# EAGLE design iBolit2_daughter (EAGLE 7.5.0)
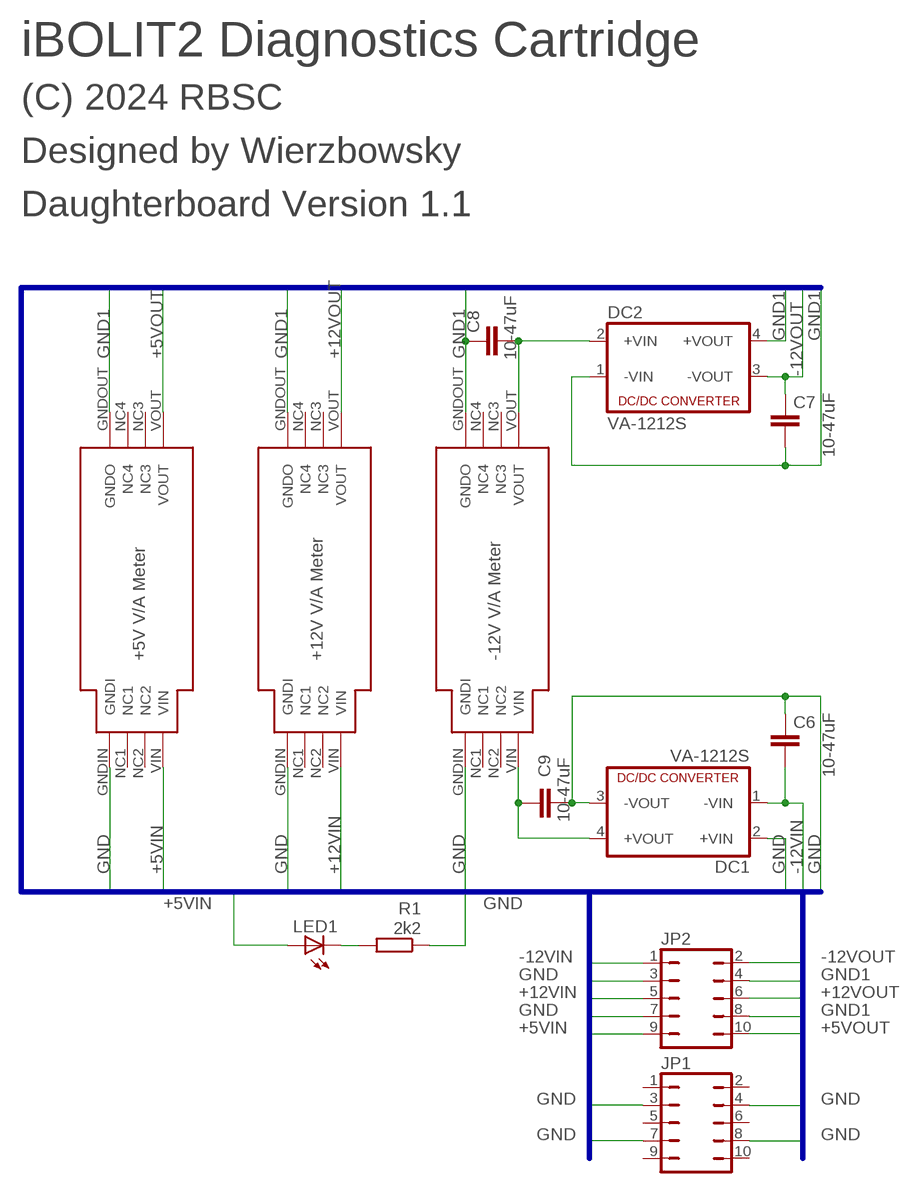
[diagram p0: schematic, sheet 1]

## Parts
C6  10-47uF  C-EUC1210  [C1210]
C7  10-47uF  C-EUC1210  [C1210]
C8  10-47uF  C-EUC1210  [C1210]
C9  10-47uF  C-EUC1210  [C1210]
DC1  VA-1212S  [4SIL]
DC2  VA-1212S  [4SIL]
JP1  JP5Q_CUSTOM  [JP5Q_CUSTOM]
JP2  JP5Q_CUSTOM  [JP5Q_CUSTOM]
LED1  LEDSQR2X5  [LED2X5]
R1  2k2  R-EU_R0805  [R0805]
X1  VA-METER2  [VA_METER2]
X2  VA-METER2  [VA_METER2]
X3  VA-METER2  [VA_METER2]

## Nets
+5VIN: JP2.9 LED1.A X1.VIN
+5VOUT: JP2.10 X1.VOUT
+12VCONVI: C9.1 DC1.4(+VOUT) X3.VIN
+12VCONVO: C8.2 DC2.2(+VIN) X3.VOUT
+12VIN: JP2.5 X2.VIN
+12VOUT: JP2.6 X2.VOUT
-12VIN: C6.2 DC1.1(-VIN) JP2.1
-12VOUT: C7.1 DC2.3(-VOUT) JP2.2
GND: C6.1 C9.2 DC1.2(+VIN) DC1.3(-VOUT) JP1.3 JP1.4 JP1.7 JP1.8 JP2.3 JP2.7 R1.1 X1.GNDIN(GNDI) X2.GNDIN(GNDI) X3.GNDIN(GNDI)
GND1: C7.2 C8.1 DC2.1(-VIN) DC2.4(+VOUT) JP2.4 JP2.8 X1.GNDOUT(GNDO) X2.GNDOUT(GNDO) X3.GNDOUT(GNDO)
N$1: LED1.K(C) R1.2
Unconnected: JP1.1 JP1.2 JP1.5 JP1.6 JP1.9 JP1.10 X1.NC1 X1.NC2 X1.NC3 X1.NC4 X2.NC1 X2.NC2 X2.NC3 X2.NC4 X3.NC1 X3.NC2 X3.NC3 X3.NC4

## Buses
D0,D1,D2,D3,D4,D5,D6,D7,A0,A1,A2,A3,A4,A5,A6,A7,A8,A9,A10,A11,A12,A13,A14,A15,SLTSL,RFSH,WAIT,INT,M1,BUSDIR,IORQ,MERQ,WR,RD,RESET,GND,CLOCK,SW1,SW2,CS1,CS2,CS12,SNDIN,GND1,GND2,+5V1,+5V2,+12V,-12V,+5VIN,+5VOUT,+12VIN,+12VOUT,-12VIN,-12VOUT,GND,GND1

## Notes on the sheet
- iBOLIT2 Diagnostics Cartridge
- (C) 2024 RBSC
- Designed by Wierzbowsky
- Daughterboard Version 1.1
- +5V V/A Meter | +12V V/A Meter | -12V V/A Meter

## Library data of the parts
C6-C9 = rcl:C-EU: CAPACITOR, European symbol
DC1 DC2 = dc-dc-converter:VA-*?: DC DC Converter Single Output, 1 Watt Motien Technology Co.,Ltd. Source: Data sheet <http://www.motien.com.tw/data_sheet/VA-1%28H%29.pdf>; OC_FARNELL: unknown; OC_NEWARK: unknown
JP1 JP2 = jumper_custom:JP5Q_CUSTOM: JUMPER
LED1 = led:LED: LED OSRAM: - CHIPLED LG R971, LG N971, LY N971, LG Q971, LY Q971, LO R971, LY R971 LH N974, LH R974 LS Q976, LO Q976, LY Q976 LO Q996 - Hyper CHIPLED LW Q18S LB Q993, LB Q99A, LB R99A - SideLED LS A670, LO A670, LY A670, LG A670, LP A670 LB A673, LV A673, LT A673, LW A673 LH A674 LY A675 LS A676, LA A676, LO A676, LY A676, LW A676 LS A679, LY A679, LG A679 - Hyper Micro SIDELED® LS Y876, LA Y876, LO Y876, LY Y876 LT Y87S - SmartLED LW L88C, LW L88S LB L89C, LB L89S, LG L890 LS L89K, LO L89K, LY L89K LS L896, LA L896, LO L896, LY L896 - TOPLED LS T670, LO T670, LY T670, LG T670, LP T670 LSG T670, LSP T670, LSY T670, LOP T670, LYG T670 LG T671, LOG T671, LSG T671 LB T673, LV T673, LT T673, LW T673 LH T674 LS T676, LA T676, LO T676, LY T676, LB T676, LH T676, LSB T676, LW T676 LB T67C, LV T67C, LT T67C, LS T67K, LO T67K, LY T67K, LW E67C LS E67B, LA E67B, LO E67B, LY E67B, LB E67C, LV E67C, LT E67C LW T67C LS T679, LY T679, LG T679 LS T770, LO T770, LY T770, LG T770, LP T770 LB T773, LV T773, LT T773, LW T773 LH T774 LS E675, LA E675, LY E675, LS T675 LS T776, LA T776, LO T776, LY T776, LB T776 LHGB T686 LT T68C, LB T68C - Hyper Mini TOPLED® LB M676 - Mini TOPLED Santana® LG M470 LS M47K, LO M47K, LY M47K Source: http://www.osram.convergy.de LUXEON: - LUMILED® LXK2-PW12-R00, LXK2-PW12-S00, LXK2-PW14-U00, LXK2-PW14-V00 LXK2-PM12-R00, LXK2-PM12-S00, LXK2-PM14-U00 LXK2-PE12-Q00, LXK2-PE12-R00, LXK2-PE12-S00, LXK2-PE14-T00, LXK2-PE14-U00 LXK2-PB12-K00, LXK2-PB12-L00, LXK2-PB12-M00, LXK2-PB14-N00, LXK2-PB14-P00, LXK2-PB14-Q00 LXK2-PR12-L00, LXK2-PR12-M00, LXK2-PR14-Q00, LXK2-PR14-R00 LXK2-PD12-Q00, LXK2-PD12-R00, LXK2-PD12-S00 LXK2-PH12-R00, LXK2-PH12-S00 LXK2-PL12-P00, LXK2-PL12-Q00, LXK2-PL12-R00 Source: www.luxeon.com KINGBRIGHT: KA-3528ASYC Source: www.kingbright.com
R1 = resistor:R-EU_: RESISTOR, European symbol
X1-X3 = va_meter2:VA-METER2: Volt-Amp Meter

## Board
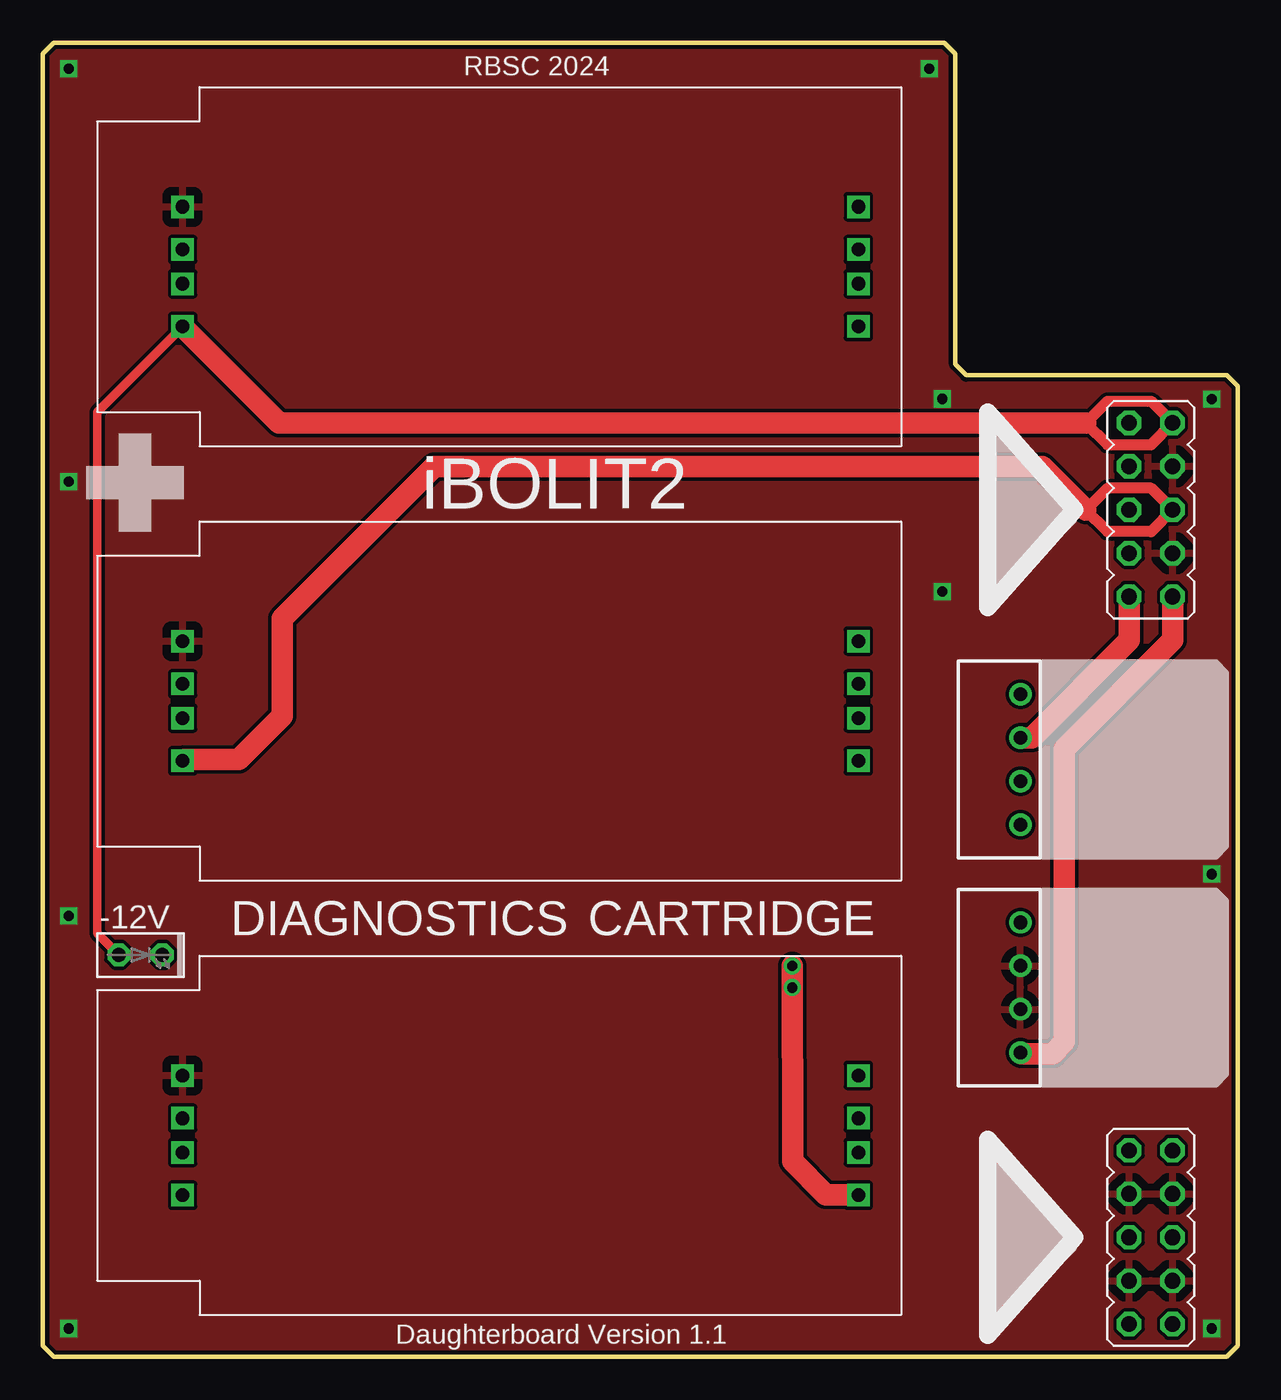
[diagram p1: board, top side]
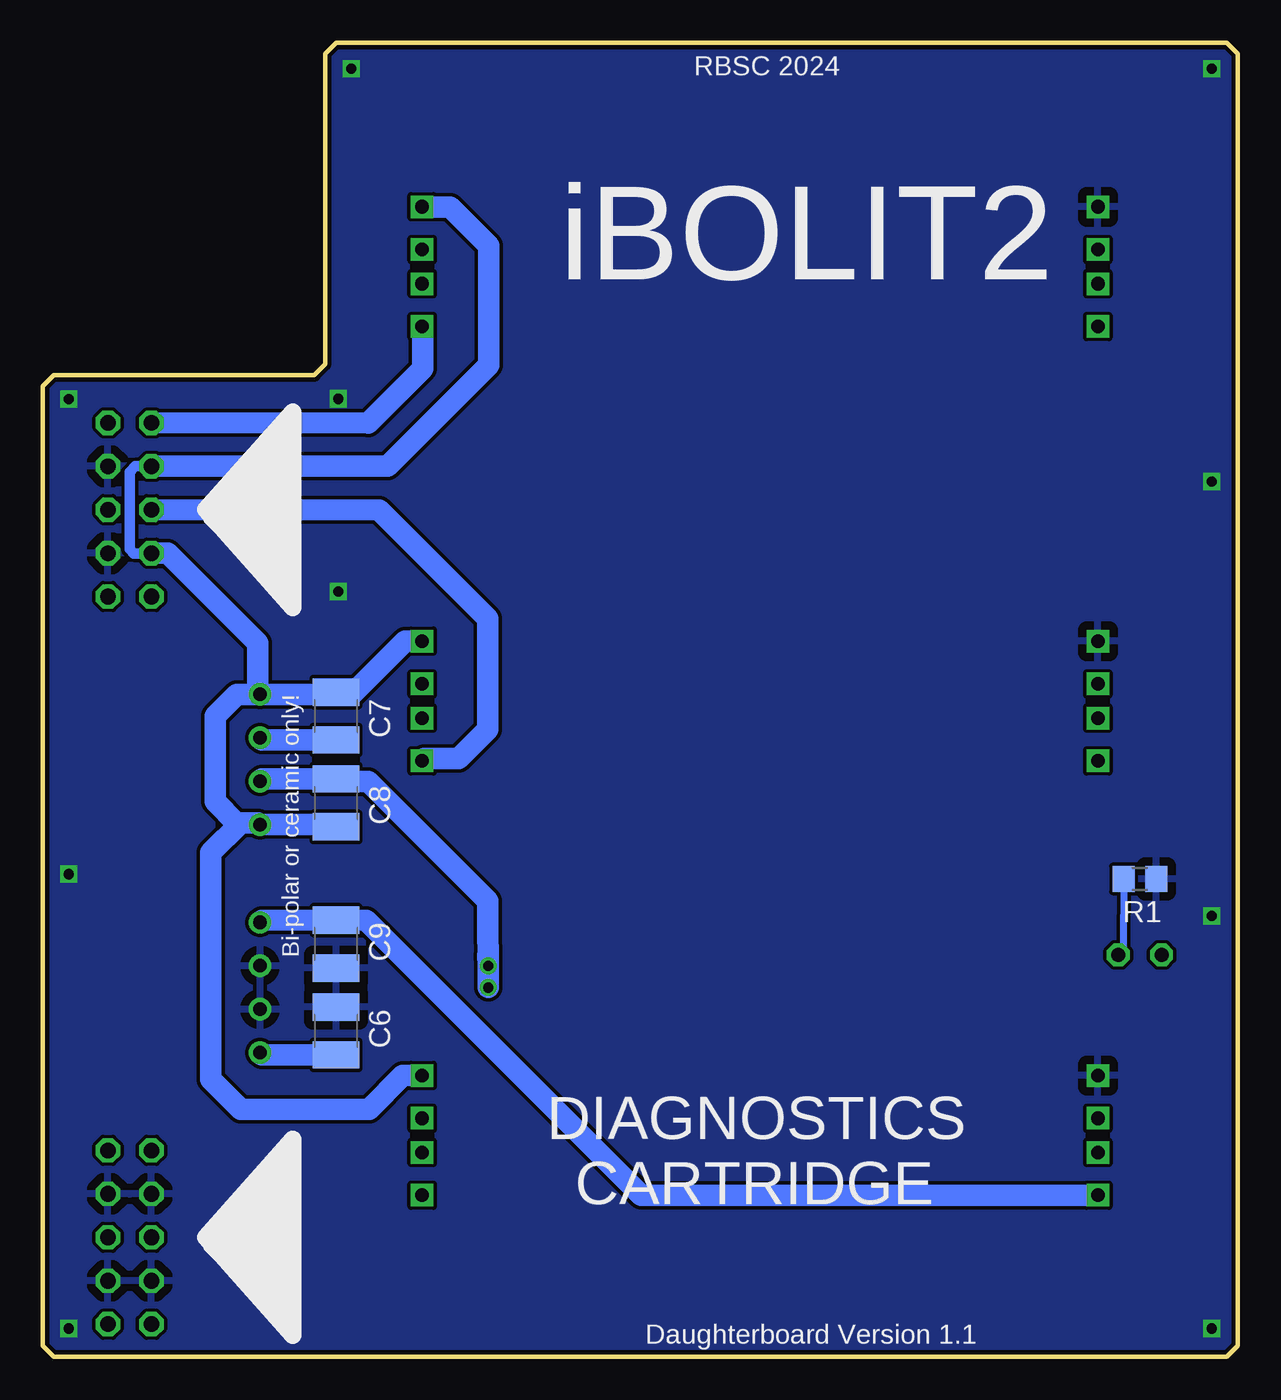
[diagram p2: board, bottom side, seen from below]

Size 69.85 x 76.83 mm. Coordinates in mm from the lower left corner, seen from the top.
Outline: 69.22,57.4 53.98,57.4 53.34,58.03 53.34,76.2 52.71,76.83 0.64,76.83 0,76.2 0,0.63 0.64,0 69.22,0 69.85,0.63 69.85,56.76 69.22,57.4
Copper layers (1*16): Top 0.035mm / dielectric 1.5mm / Bottom 0.035mm
Design rules "default *": minimum track width 10mil, minimum drill 24mil, track to track 8mil, track to pad 8mil, pad to pad 8mil, via to via 8mil, smd to smd 8mil, copper to edge 10mil, drill to drill 8mil, minimum pad ring 10mil, minimum via ring 8mil, stop-mask expansion 4mil, vias tented up to drill 25mil, thermal gap 20mil

### Footprints (pad centres in the part's own frame; a part is rotated, then mirrored left to right if it is on the bottom)
C1210 = smd 1.6 x 2.7: 1 -1.4,0; 2 1.4,0
4SIL = drill 0.8: 1 -3.81,0; 2 -1.27,0; 3 1.27,0; 4 3.81,0
JP5Q_CUSTOM = drill 0.914 octagon: 1 -5.08,-1.27; 2 -5.08,1.27; 3 -2.54,-1.27; 4 -2.54,1.27; 5 0,-1.27; 6 0,1.27; 7 2.54,-1.27; 8 2.54,1.27; 9 5.08,-1.27; 10 5.08,1.27
LED2X5 = drill 0.813 octagon: A -1.27,0; K 1.27,0
R0805 = smd 1.3 x 1.5: 1 -0.95,0; 2 0.95,0
VA_METER2 = drill 0.8 square: GNDIN 5,12; GNDOUT 44.5,12; NC1 5,9.5; NC2 5,7.5; NC3 44.5,7.5; NC4 44.5,9.5; VIN 5,5; VOUT 44.5,5

### Placement (x,y rotation side)
C6  52.71,19.05 270 bottom
C7  52.71,37.47 90 bottom
C8  52.71,32.39 90 bottom
C9  52.71,24.13 270 bottom
DC1  57.15,21.59 90 top
DC2  57.15,34.93 90 top
JP1  64.77,6.98 90 top
JP2  64.77,49.53 90 top
LED1  5.71,23.49 0 top
R1  5.71,27.94 180 bottom
X1  3.17,55.25 0 top
X2  3.17,29.84 0 top
X3  3.17,4.44 0 top

### Tracks (layer width: path | path; a pad name or v marks a point on that pad's centre or on a via)
+5VIN
  Top 0.508: LED1.A 3.19,24.75 3.19,55.23 X1.VIN
  Top 0.635: 60.98,54.6 62.25,55.87 64.79,55.87 JP2.9 64.79,53.33 62.25,53.33 60.98,54.6
  Top 1.27: 60.98,54.6 13.83,54.6 X1.VIN
+5VOUT
  Bottom 1.27: JP2.10 50.82,54.6 47.64,57.77 47.64,60.18 X1.VOUT
+12VCONVI
  Bottom 0.762: 57.04,25.52 DC1.4
  Bottom 1.27: 57.04,25.52 C9.1 50.95,25.52 34.86,9.43 X3.VIN
+12VCONVO  (via drill 0.6)
  Top 1.27: v43.82,22.86 v43.82,21.59 43.83,13.29 43.83,11.42 45.78,9.47 47.65,9.47 X3.VOUT
  Bottom 0.762: 57.04,33.77 DC2.2 | 52.59,33.64 C8.2
  Bottom 1.27: C8.2 57.04,33.77 | 43.83,23.48 v43.82,22.86 v43.82,21.59 43.83,26.66 50.82,33.64 52.59,33.64
+12VIN
  Top 0.635: JP2.5 64.79,48.25 62.25,48.25 60.98,49.52 62.25,50.79 64.79,50.79 JP2.5
  Top 1.27: 60.98,49.52 58.44,52.06 22.88,52.06 13.99,43.17 13.99,37.45 11.45,34.91 8.27,34.91 X2.VIN
+12VOUT
  Bottom 1.27: JP2.6 50.18,49.52 43.83,43.17 43.83,36.67 45.53,34.97 47.55,34.97 X2.VOUT
-12VIN
  Top 1.27: JP2.1 66.06,41.9 59.71,35.55 59.71,18.4 59.03,17.72 57.21,17.72 DC1.1
  Bottom 0.762: 57.04,17.64 DC1.1
  Bottom 1.27: C6.2 57.04,17.64
-12VOUT
  Top 1.27: JP2.2 63.52,41.9 57.8,36.18 DC2.3
  Bottom 0.762: 57.04,36.05 DC2.3
  Bottom 1.27: C7.1 57.04,36.05
GND  (via drill 0.6)
  other vias: 1.52,75.31 51.82,75.31 52.58,56.01 68.33,56 68.33,1.65 1.52,1.65 1.52,25.78 1.52,51.18 68.33,28.22 52.58,44.75
  pour Top: 0.02,76.82 53.36,76.82 53.36,57.39 69.87,57.39 69.87,-0.01 0.02,-0.01
  pour Bottom: 0.02,76.82 53.36,76.82 53.36,57.39 69.87,57.39 69.87,-0.01 0.02,-0.01
GND1
  Bottom 0.6: JP2.8 64.43,52.07 64.78,51.72 64.78,47.22 64.53,46.97 63.52,46.97 JP2.4
  Bottom 1.27: JP2.8 49.68,52.07 43.78,57.97 43.78,64.97 46.03,67.22 47.65,67.22 X1.GNDOUT | JP2.4 62.54,46.99 57.28,41.72 57.28,38.86 DC2.4 | DC2.4 52.84,38.73 C7.2 52.56,38.72 51.78,38.72 48.66,41.84 X2.GNDOUT | C8.1 52.84,31.11 DC2.1 57.26,31.22 58.28,31.22 | DC2.4 58.52,38.73 59.78,37.47 59.78,32.47 58.53,31.22 58.28,31.22 | X3.GNDOUT 48.81,16.44 50.78,14.47 58.28,14.47 60.03,16.22 60.03,29.47 58.28,31.22
N$1
  Bottom 0.406: R1.2 6.68,23.8 LED1.K

### Text on the board
tNames: RBSC 2024 | iBOLIT2 | DIAGNOSTICS | CARTRIDGE | -12V | Daughterboard Version 1.1
bNames: RBSC 2024 | iBOLIT2 | Bi-polar or ceramic only! | DIAGNOSTICS | CARTRIDGE | Daughterboard Version 1.1